# Altium schematic sheet EP4CE75.SchDoc
size A1
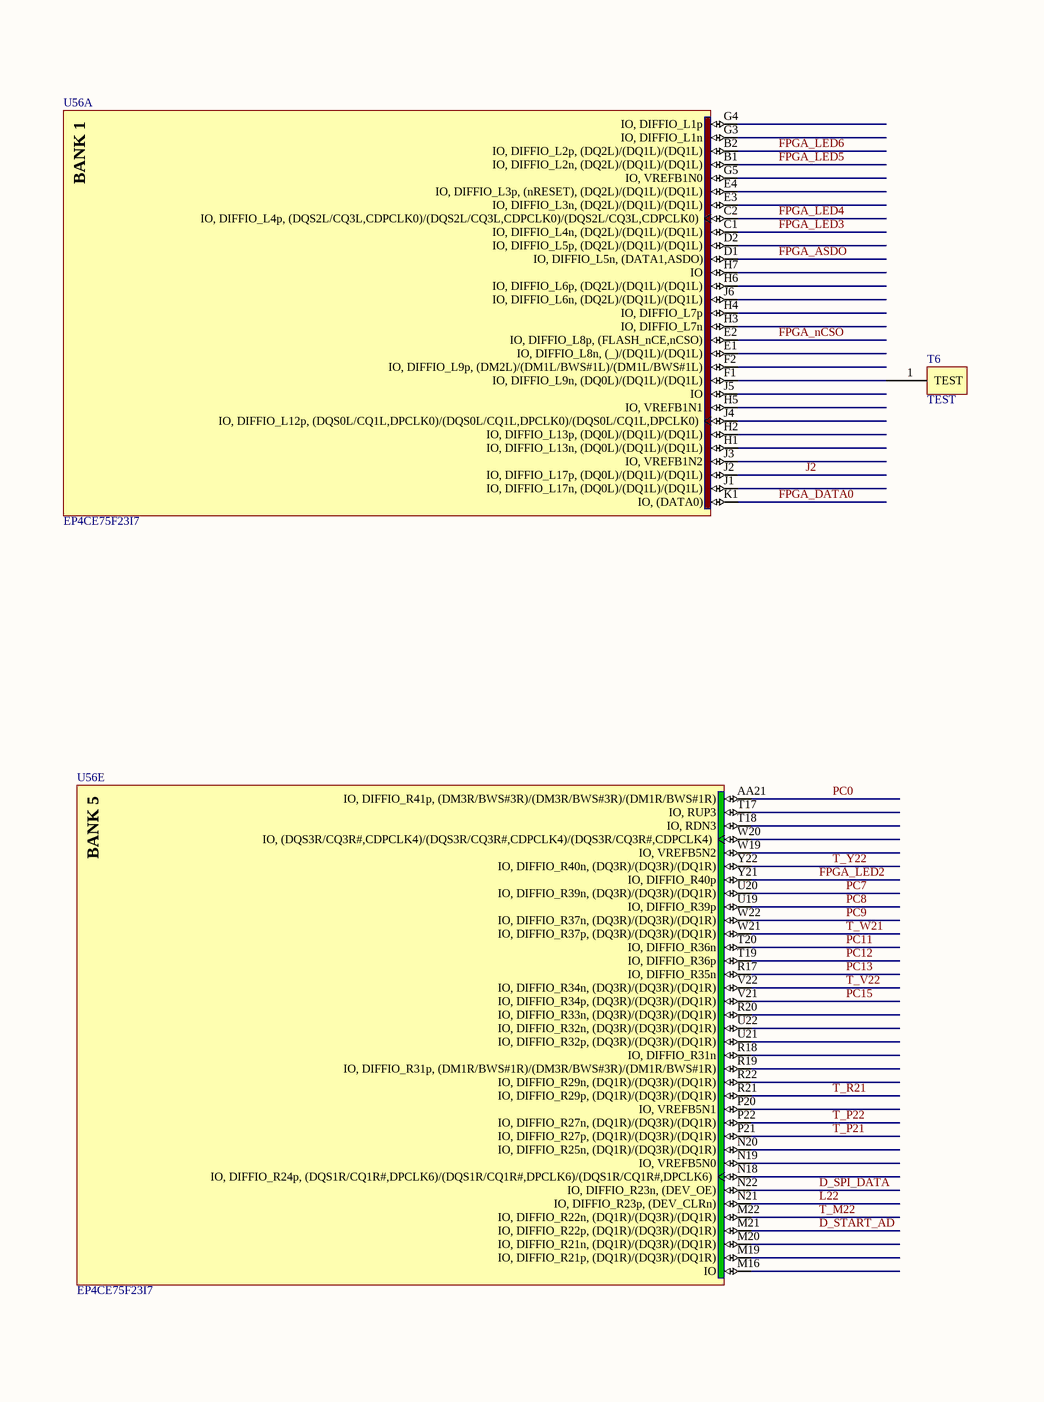
[diagram p0: EP4CE75.SchDoc, top left]
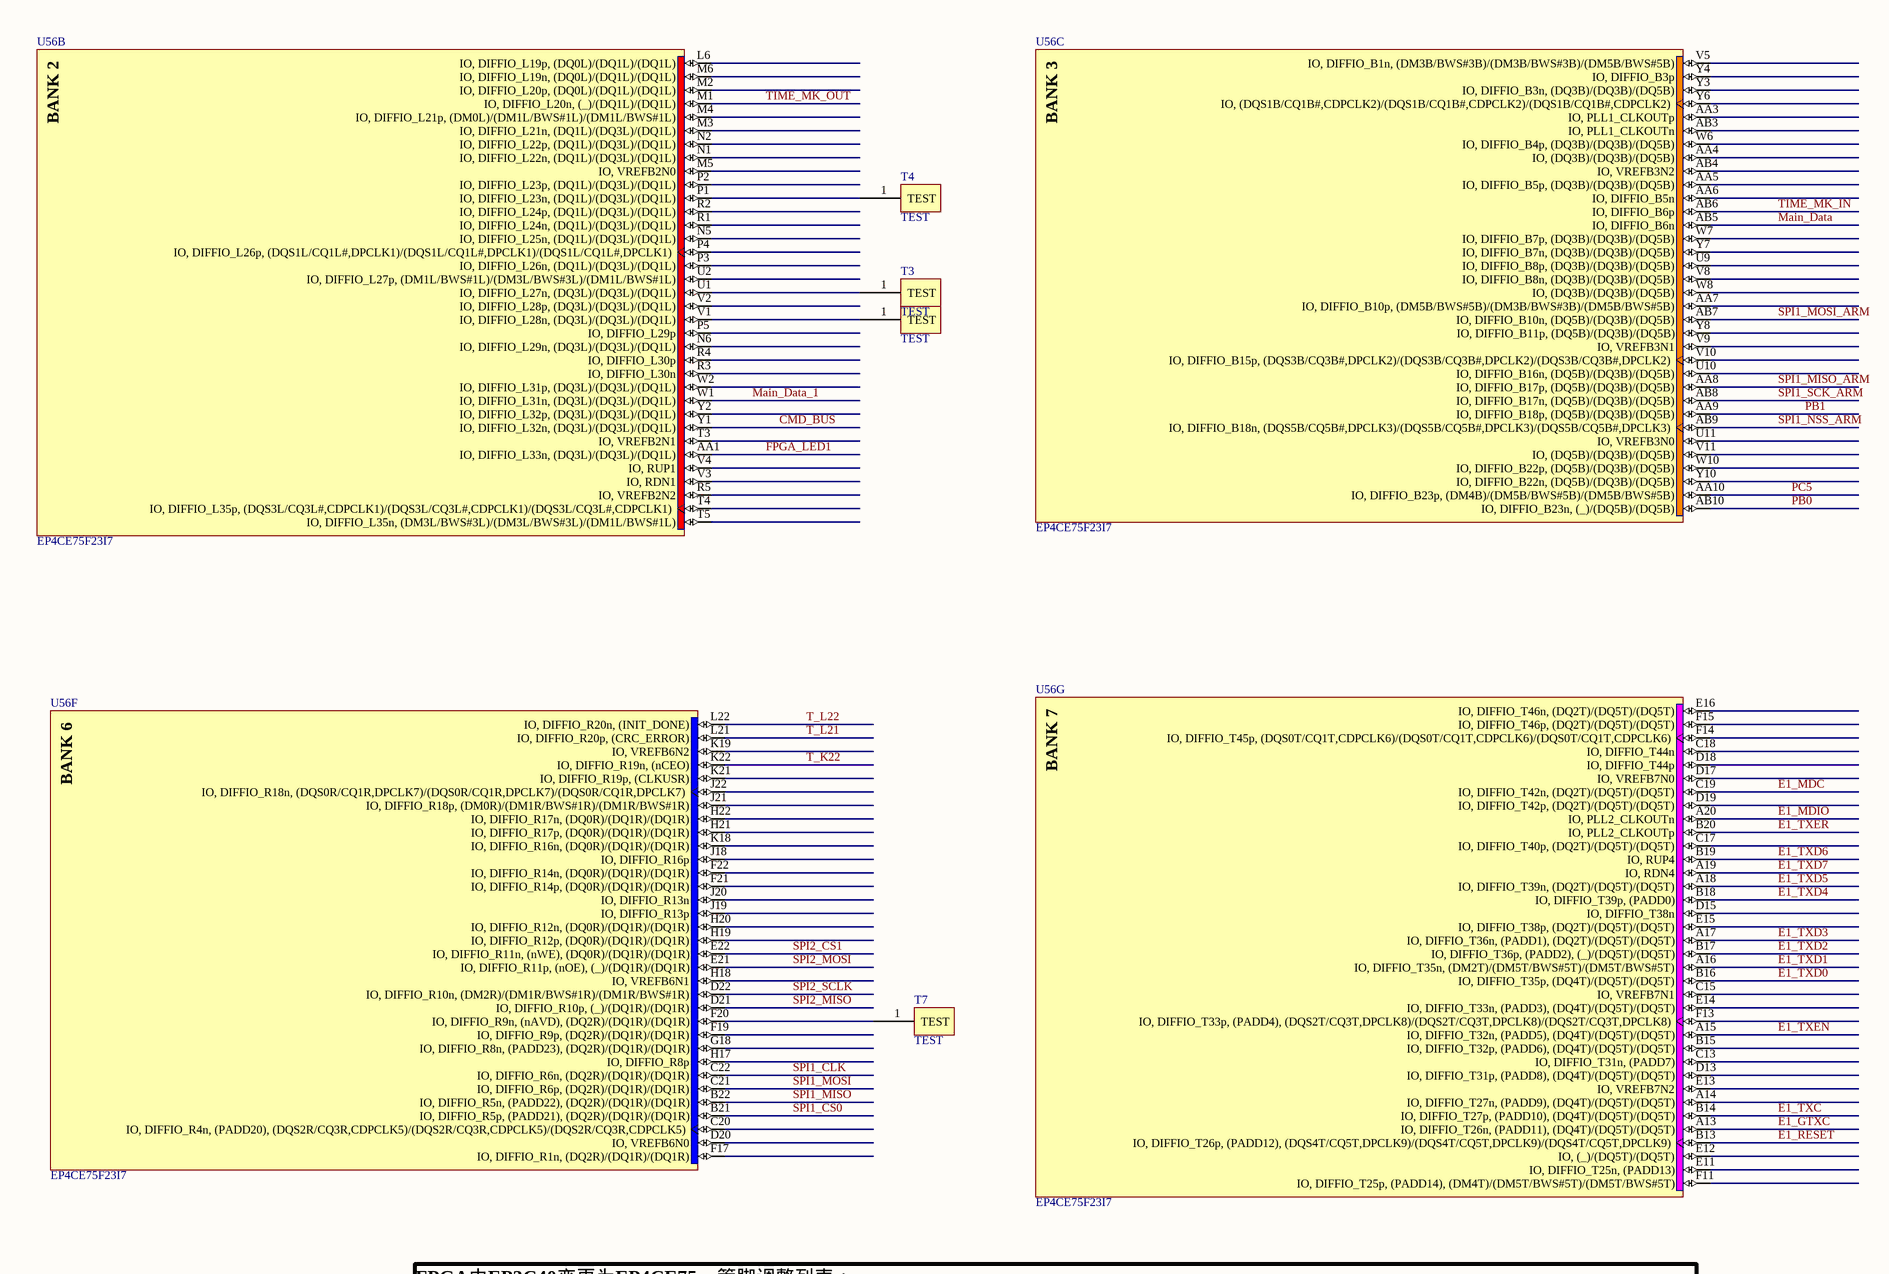
[diagram p1: EP4CE75.SchDoc, top middle]
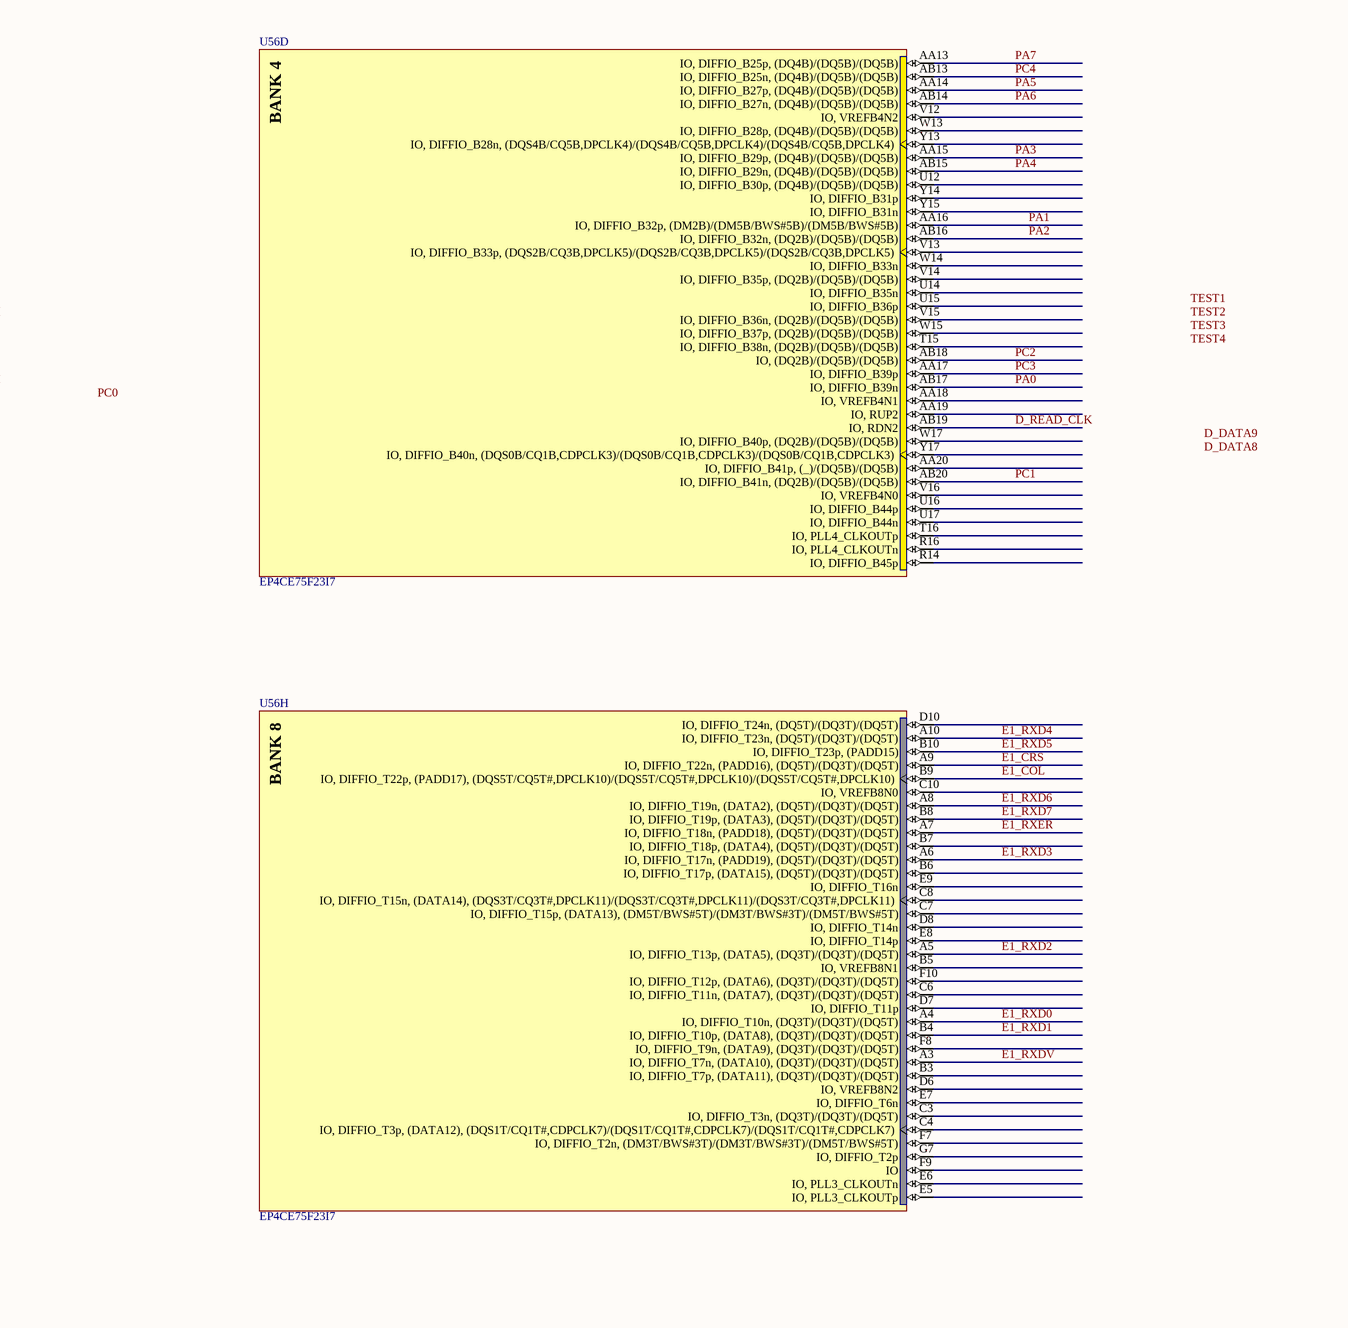
[diagram p2: EP4CE75.SchDoc, top right]
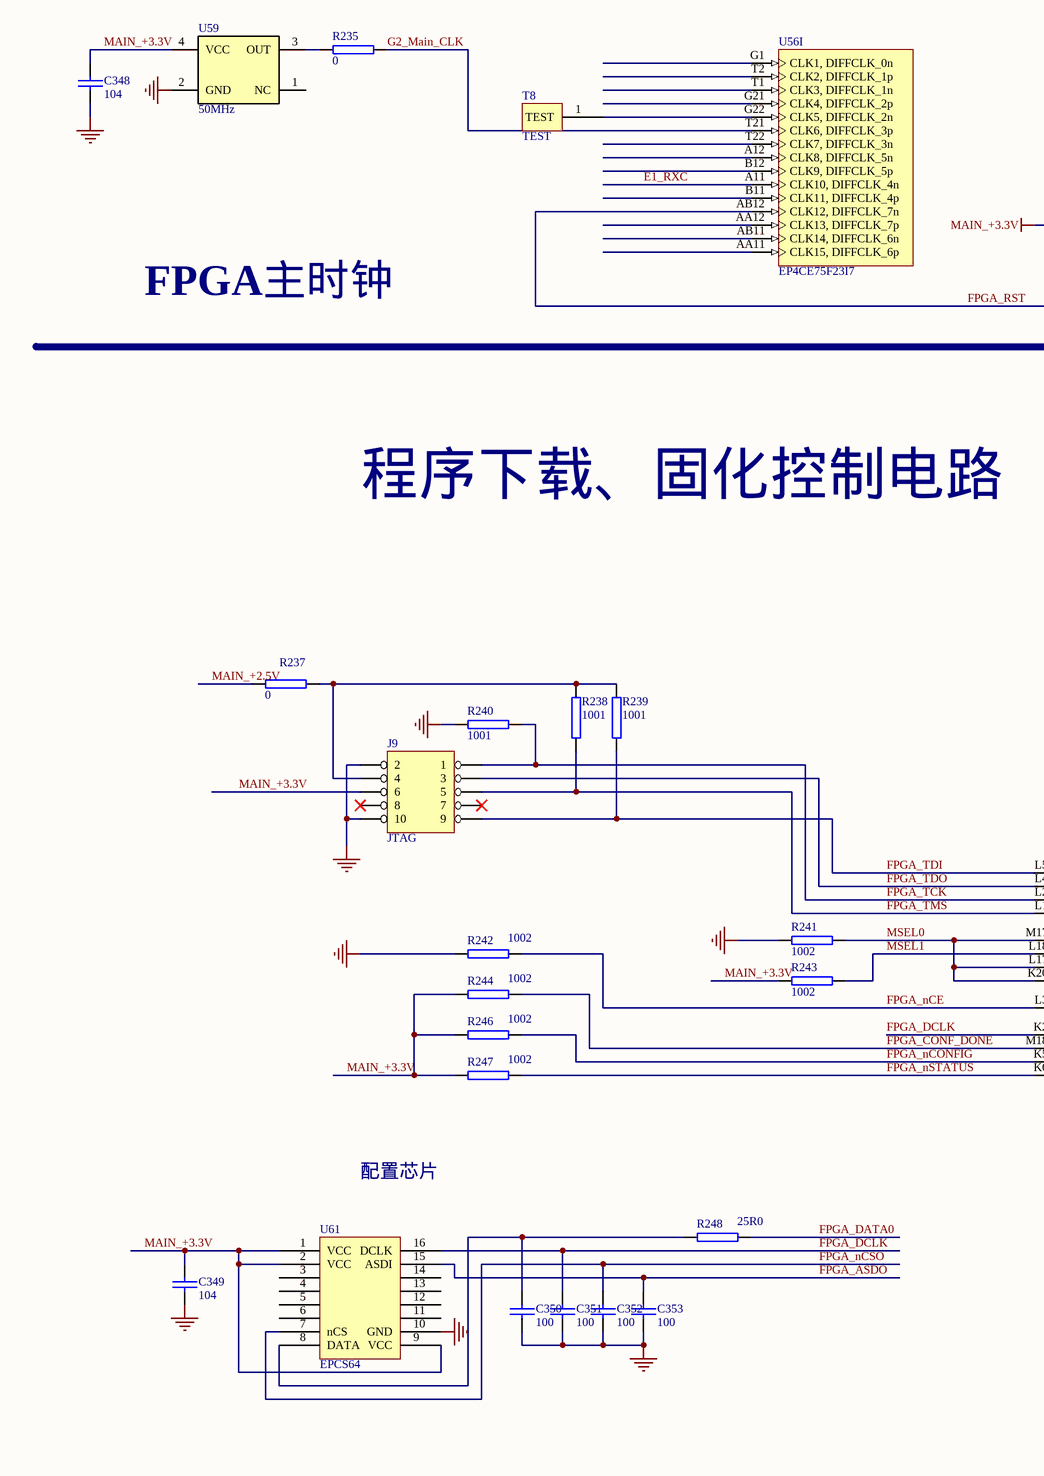
[diagram p3: EP4CE75.SchDoc, bottom left]
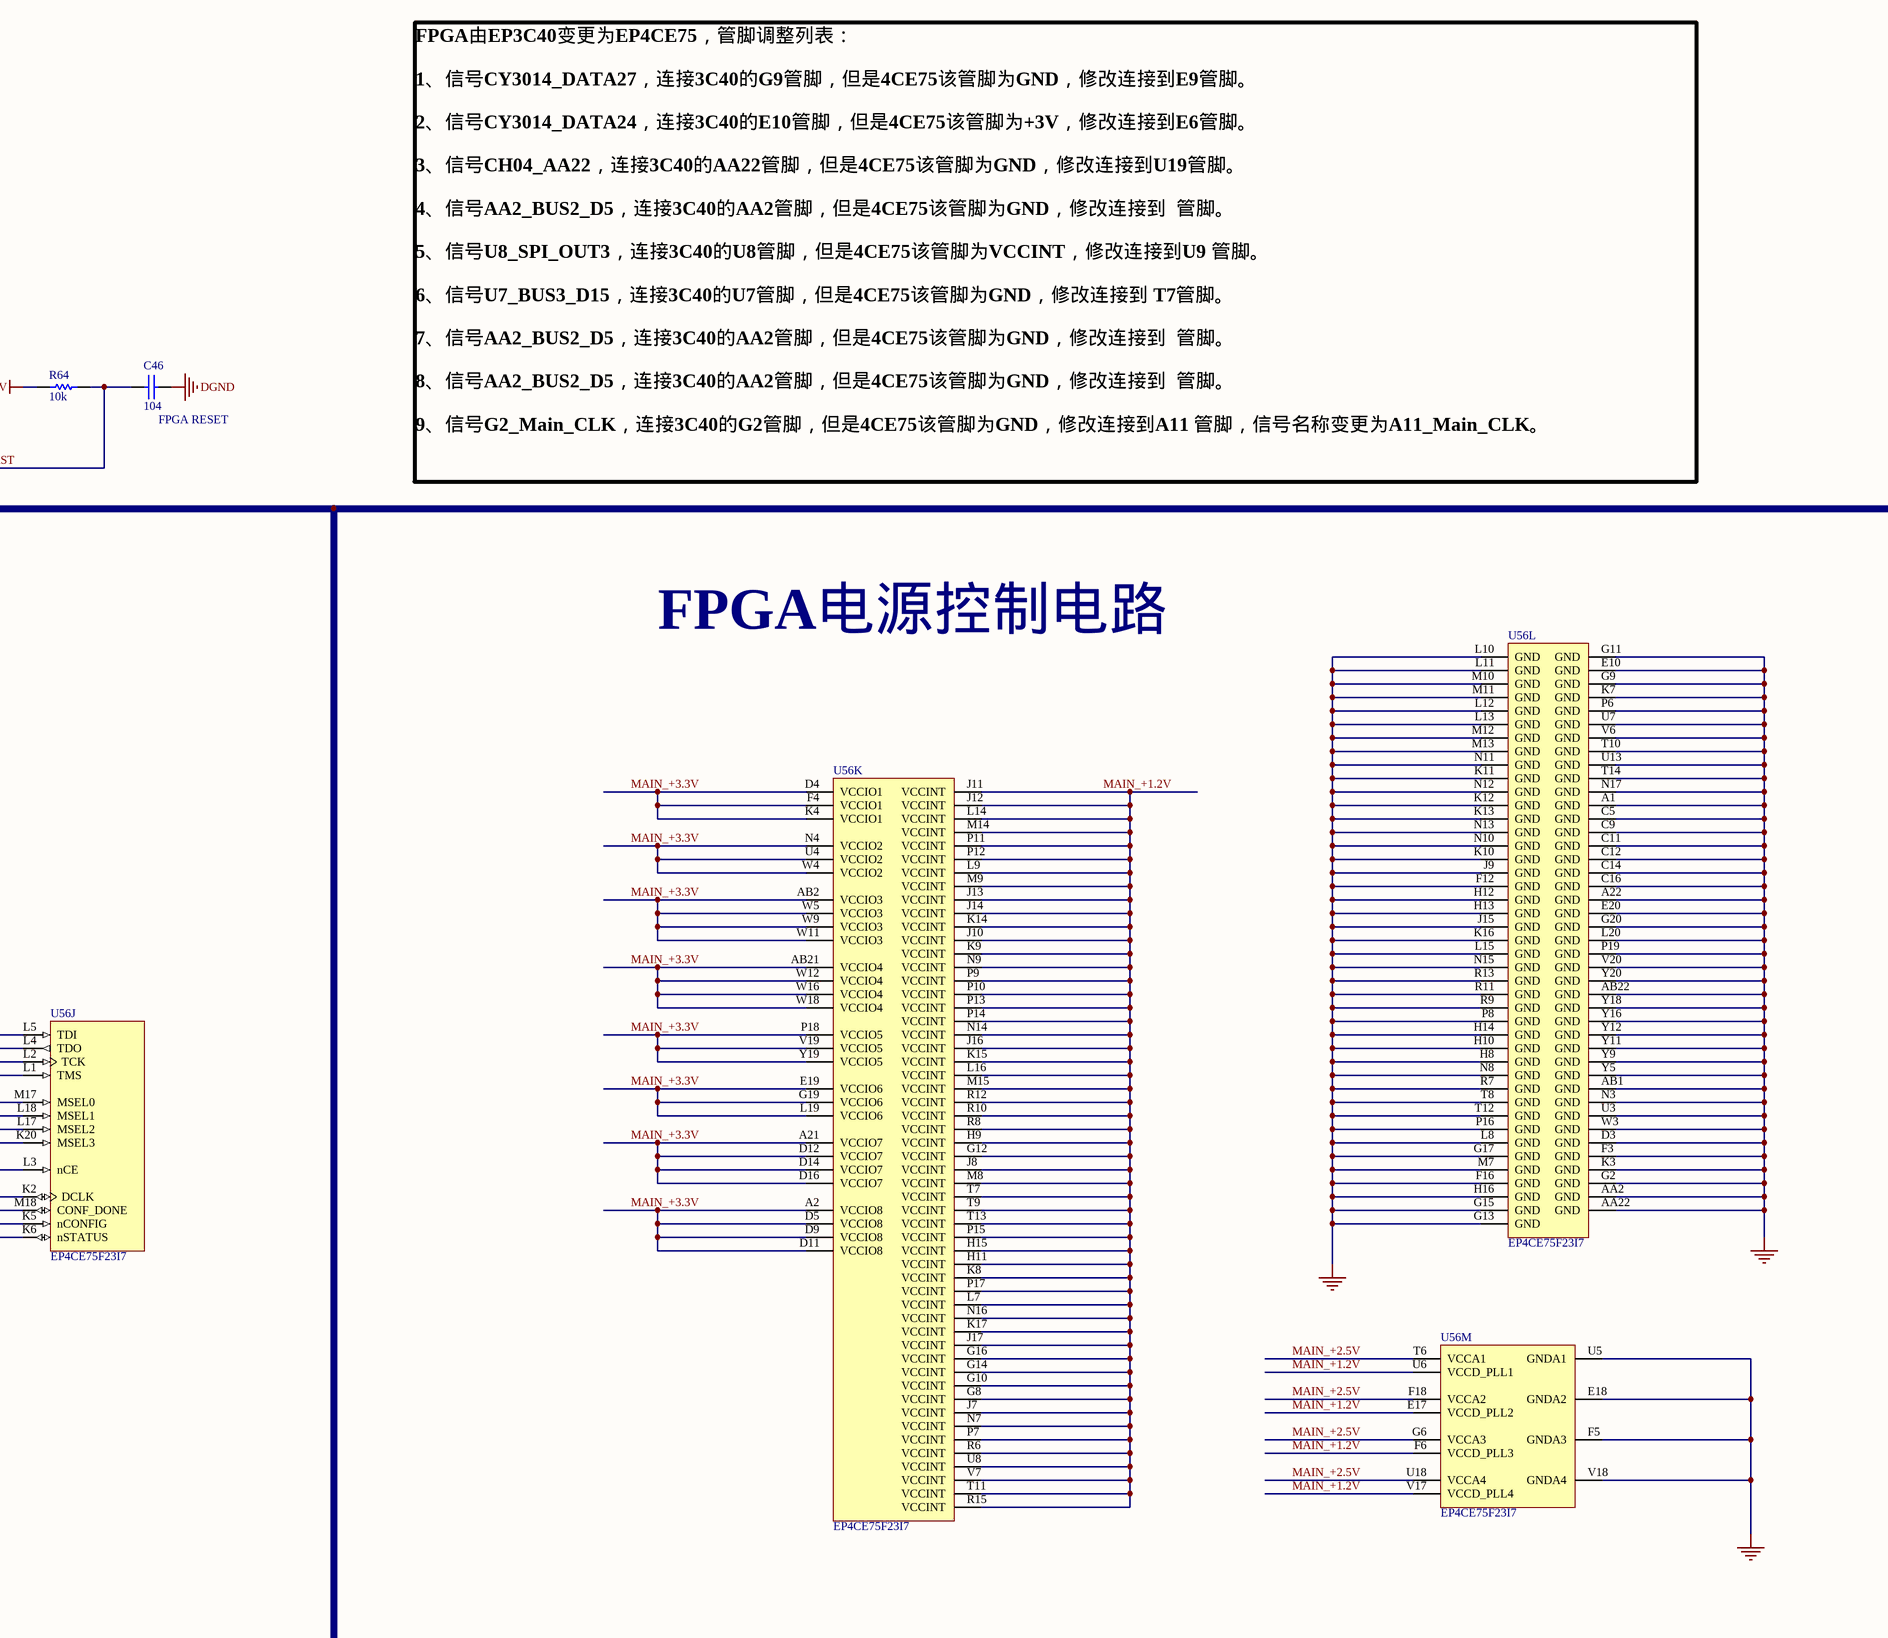
[diagram p4: EP4CE75.SchDoc, bottom middle]
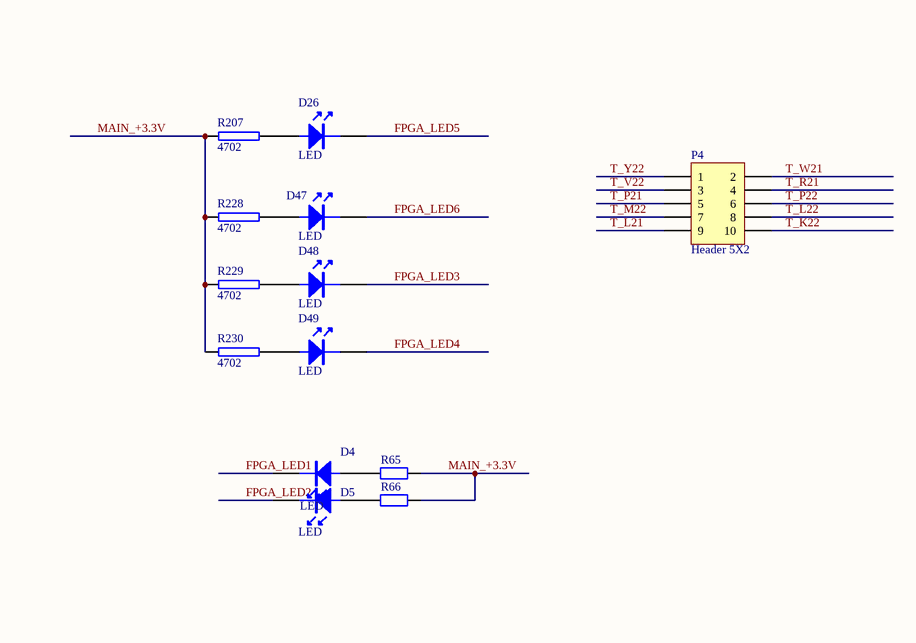
[diagram p5: EP4CE75.SchDoc, bottom right]

## Parts
C46  104  [0805C]
C348  104  [0805C]
C349  104  [0805C]
C350  100  [0805C]
C351  100  [0805C]
C352  100  [0805C]
C353  100  [0805C]
D4  LED  [0805_LED]
D5  LED  [0805_LED]
D26  LED  [0805_LED]
D47  LED  [0805_LED]
D48  LED  [0805_LED]
D49  LED  [0805_LED]
J9  JTAG  [IDC10]
P4  Header 5X2  [HDR2X5]
R64  10k  [0805R]
R65  4701  [0805R]  (value not drawn)
R66  4701  [0805R]  (value not drawn)
R207  4702  [0805R]
R228  4702  [0805R]
R229  4702  [0805R]
R230  4702  [0805R]
R235  0  [0805R]
R237  0  [0805R]
R238  1001  [0805R]
R239  1001  [0805R]
R240  1001  [0805R]
R241  1002  [0805R]
R242  1002  [0402]
R243  1002  [0805R]
R244  1002  [0402]
R246  1002  [0402]
R247  1002  [0402]
R248  25R0  [0805R]
T3  TEST  [TEST_MINI]
T4  TEST  [TEST_MINI]
T5  TEST  [TEST_MINI]
T6  TEST  [TEST_MINI]
T7  TEST  [TEST_MINI]
T8  TEST  [TEST_MINI]
U56  EP4CE75F23I7  [FBGA484-3]  (parts A,B,C,D,E,F,G,H,I,J,K,L,M of 13)
U59  50MHz  [CLOCK4]
U61  EPCS64  [EPCS64_SOIC16]

## Nets
DGND: C46.2 C348.1 C349.1 C350.1 C351.1 C352.1 C353.1 J9.2 J9.10 R240.1 R241.1 R242.2 U56.A1(GND) U56.A22(GND) U56.AA2(GND) U56.AA22(GND) U56.AB1(GND) U56.AB22(GND) U56.C5(GND) U56.C9(GND) U56.C11(GND) U56.C12(GND) U56.C14(GND) U56.C16(GND) U56.D3(GND) U56.E10(GND) U56.E18(GNDA2) U56.E20(GND) U56.F3(GND) U56.F5(GNDA3) U56.F12(GND) U56.F16(GND) U56.G2(GND) U56.G9(GND) U56.G11(GND) U56.G13(GND) U56.G15(GND) U56.G17(GND) U56.G20(GND) U56.H8(GND) U56.H10(GND) U56.H12(GND) U56.H13(GND) U56.H14(GND) U56.H16(GND) U56.J9(GND) U56.J15(GND) U56.K3(GND) U56.K7(GND) U56.K10(GND) U56.K11(GND) U56.K12(GND) U56.K13(GND) U56.K16(GND) U56.L8(GND) U56.L10(GND) U56.L11(GND) U56.L12(GND) U56.L13(GND) U56.L15(GND) U56.L20(GND) U56.M7(GND) U56.M10(GND) U56.M11(GND) U56.M12(GND) U56.M13(GND) U56.N3(GND) U56.N8(GND) U56.N10(GND) U56.N11(GND) U56.N12(GND) U56.N13(GND) U56.N15(GND) U56.N17(GND) U56.P6(GND) U56.P8(GND) U56.P16(GND) U56.P19(GND) U56.R7(GND) U56.R9(GND) U56.R11(GND) U56.R13(GND) U56.T8(GND) U56.T10(GND) U56.T12(GND) U56.T14(GND) U56.U3(GND) U56.U5(GNDA1) U56.U7(GND) U56.U13(GND) U56.V6(GND) U56.V18(GNDA4) U56.V20(GND) U56.W3(GND) U56.Y5(GND) U56.Y9(GND) U56.Y11(GND) U56.Y12(GND) U56.Y16(GND) U56.Y18(GND) U56.Y20(GND) U59.2(GND) U61.10(GND)
MAIN_+3.3V: C348.2 C349.2 J9.6 R64.2 R65.2 R66.2 R207.2 R228.2 R229.2 R230.2 R243.1 R244.1 R246.2 R247.2 U56.A2(VCCIO8) U56.A21(VCCIO7) U56.AB2(VCCIO3) U56.AB21(VCCIO4) U56.D4(VCCIO1) U56.D5(VCCIO8) U56.D9(VCCIO8) U56.D11(VCCIO8) U56.D12(VCCIO7) U56.D14(VCCIO7) U56.D16(VCCIO7) U56.E19(VCCIO6) U56.F4(VCCIO1) U56.G19(VCCIO6) U56.K4(VCCIO1) U56.L19(VCCIO6) U56.N4(VCCIO2) U56.P18(VCCIO5) U56.U4(VCCIO2) U56.V19(VCCIO5) U56.W4(VCCIO2) U56.W5(VCCIO3) U56.W9(VCCIO3) U56.W11(VCCIO3) U56.W12(VCCIO4) U56.W16(VCCIO4) U56.W18(VCCIO4) U56.Y19(VCCIO5) U59.4(VCC) U61.1(VCC) U61.2(VCC) U61.9(VCC)
CMD_BUS: U56.Y1(IO,_DIFFIO_L32n,_(DQ3L)/(DQ3L)/(DQ1L))
D_READ_CLK: U56.AB19(IO,_RDN2)
D_SPI_DATA: U56.N22(IO,_DIFFIO_R23n,_(DEV_OE))
D_START_AD: U56.M21(IO,_DIFFIO_R22p,_(DQ1R)/(DQ3R)/(DQ1R))
E1_COL: U56.B9(IO,_DIFFIO_T22p,_(PADD17),_(DQS5T/CQ5T#,DPCLK10)/(DQS5T/CQ5T#,DPCLK10)/(DQS5T/CQ5T#,DPCLK10))
E1_CRS: U56.A9(IO,_DIFFIO_T22n,_(PADD16),_(DQ5T)/(DQ3T)/(DQ5T))
E1_GTXC: U56.A13(IO,_DIFFIO_T26n,_(PADD11),_(DQ4T)/(DQ5T)/(DQ5T))
E1_MDC: U56.C19(IO,_DIFFIO_T42n,_(DQ2T)/(DQ5T)/(DQ5T))
E1_MDIO: U56.A20(IO,_PLL2_CLKOUTn)
E1_RESET: U56.B13(IO,_DIFFIO_T26p,_(PADD12),_(DQS4T/CQ5T,DPCLK9)/(DQS4T/CQ5T,DPCLK9)/(DQS4T/CQ5T,DPCLK9))
E1_RXC: U56.A11(CLK10,_DIFFCLK_4n)
E1_RXD0: U56.A4(IO,_DIFFIO_T10n,_(DQ3T)/(DQ3T)/(DQ5T))
E1_RXD1: U56.B4(IO,_DIFFIO_T10p,_(DATA8),_(DQ3T)/(DQ3T)/(DQ5T))
E1_RXD2: U56.A5(IO,_DIFFIO_T13p,_(DATA5),_(DQ3T)/(DQ3T)/(DQ5T))
E1_RXD3: U56.A6(IO,_DIFFIO_T17n,_(PADD19),_(DQ5T)/(DQ3T)/(DQ5T))
E1_RXD4: U56.A10(IO,_DIFFIO_T23n,_(DQ5T)/(DQ3T)/(DQ5T))
E1_RXD5: U56.B10(IO,_DIFFIO_T23p,_(PADD15))
E1_RXD6: U56.A8(IO,_DIFFIO_T19n,_(DATA2),_(DQ5T)/(DQ3T)/(DQ5T))
E1_RXD7: U56.B8(IO,_DIFFIO_T19p,_(DATA3),_(DQ5T)/(DQ3T)/(DQ5T))
E1_RXDV: U56.A3(IO,_DIFFIO_T7n,_(DATA10),_(DQ3T)/(DQ3T)/(DQ5T))
E1_RXER: U56.A7(IO,_DIFFIO_T18n,_(PADD18),_(DQ5T)/(DQ3T)/(DQ5T))
E1_TXC: U56.B14(IO,_DIFFIO_T27p,_(PADD10),_(DQ4T)/(DQ5T)/(DQ5T))
E1_TXD0: U56.B16(IO,_DIFFIO_T35p,_(DQ4T)/(DQ5T)/(DQ5T))
E1_TXD1: U56.A16(IO,_DIFFIO_T35n,_(DM2T)/(DM5T/BWS#5T)/(DM5T/BWS#5T))
E1_TXD2: U56.B17(IO,_DIFFIO_T36p,_(PADD2),_(_)/(DQ5T)/(DQ5T))
E1_TXD3: U56.A17(IO,_DIFFIO_T36n,_(PADD1),_(DQ2T)/(DQ5T)/(DQ5T))
E1_TXD4: U56.B18(IO,_DIFFIO_T39p,_(PADD0))
E1_TXD5: U56.A18(IO,_DIFFIO_T39n,_(DQ2T)/(DQ5T)/(DQ5T))
E1_TXD6: U56.B19(IO,_RUP4)
E1_TXD7: U56.A19(IO,_RDN4)
E1_TXEN: U56.A15(IO,_DIFFIO_T32n,_(PADD5),_(DQ4T)/(DQ5T)/(DQ5T))
E1_TXER: U56.B20(IO,_PLL2_CLKOUTp)
FPGA_ASDO: C353.2 U56.D1(IO,_DIFFIO_L5n,_(DATA1,ASDO)) U61.15(ASDI)
FPGA_CONF_DONE: R244.2 U56.M18(CONF_DONE)
FPGA_DATA0: R248.1 U56.K1(IO,_(DATA0))
FPGA_DCLK: C351.2 U56.K2(DCLK) U61.16(DCLK)
FPGA_LED1: D4.2(K) U56.AA1(IO,_DIFFIO_L33n,_(DQ3L)/(DQ3L)/(DQ1L))
FPGA_LED2: D5.2(K) U56.Y21(IO,_DIFFIO_R40p)
FPGA_LED3: D48.2(K) U56.C1(IO,_DIFFIO_L4n,_(DQ2L)/(DQ1L)/(DQ1L))
FPGA_LED4: D49.2(K) U56.C2(IO,_DIFFIO_L4p,_(DQS2L/CQ3L,CDPCLK0)/(DQS2L/CQ3L,CDPCLK0)/(DQS2L/CQ3L,CDPCLK0))
FPGA_LED5: D26.2(K) U56.B1(IO,_DIFFIO_L2n,_(DQ2L)/(DQ1L)/(DQ1L))
FPGA_LED6: D47.2(K) U56.B2(IO,_DIFFIO_L2p,_(DQ2L)/(DQ1L)/(DQ1L))
FPGA_nCE: R242.1 U56.L3(nCE)
FPGA_nCONFIG: R246.1 U56.K5(nCONFIG)
FPGA_nCSO: C352.2 U56.E2(IO,_DIFFIO_L8p,_(FLASH_nCE,nCSO)) U61.7(nCS)
FPGA_nSTATUS: R247.1 U56.K6(nSTATUS)
FPGA_RST: C46.1 R64.1 U56.AB12(CLK12,_DIFFCLK_7n)
FPGA_TCK: J9.1 R240.2 U56.L2(TCK)
FPGA_TDI: J9.9 R239.1 U56.L5(TDI)
FPGA_TDO: J9.3 U56.L4(TDO)
FPGA_TMS: J9.5 R238.1 U56.L1(TMS)
G2_Main_CLK: R235.2 U56.T21(CLK6,_DIFFCLK_3p)
J2: U56.J2(IO,_DIFFIO_L17p,_(DQ0L)/(DQ1L)/(DQ1L))
L22: U56.N21(IO,_DIFFIO_R23p,_(DEV_CLRn))
MAIN_+1.2V: U56.E17(VCCD_PLL2) U56.F6(VCCD_PLL3) U56.G8(VCCINT) U56.G10(VCCINT) U56.G12(VCCINT) U56.G14(VCCINT) U56.G16(VCCINT) U56.H9(VCCINT) U56.H11(VCCINT) U56.H15(VCCINT) U56.J7(VCCINT) U56.J8(VCCINT) U56.J10(VCCINT) U56.J11(VCCINT) U56.J12(VCCINT) U56.J13(VCCINT) U56.J14(VCCINT) U56.J16(VCCINT) U56.J17(VCCINT) U56.K8(VCCINT) U56.K9(VCCINT) U56.K14(VCCINT) U56.K15(VCCINT) U56.K17(VCCINT) U56.L7(VCCINT) U56.L9(VCCINT) U56.L14(VCCINT) U56.L16(VCCINT) U56.M8(VCCINT) U56.M9(VCCINT) U56.M14(VCCINT) U56.M15(VCCINT) U56.N7(VCCINT) U56.N9(VCCINT) U56.N14(VCCINT) U56.N16(VCCINT) U56.P7(VCCINT) U56.P9(VCCINT) U56.P10(VCCINT) U56.P11(VCCINT) U56.P12(VCCINT) U56.P13(VCCINT) U56.P14(VCCINT) U56.P15(VCCINT) U56.P17(VCCINT) U56.R6(VCCINT) U56.R8(VCCINT) U56.R10(VCCINT) U56.R12(VCCINT) U56.R15(VCCINT) U56.T7(VCCINT) U56.T9(VCCINT) U56.T11(VCCINT) U56.T13(VCCINT) U56.U6(VCCD_PLL1) U56.U8(VCCINT) U56.V7(VCCINT) U56.V17(VCCD_PLL4)
MAIN_+2.5V: R237.1 U56.F18(VCCA2) U56.G6(VCCA3) U56.T6(VCCA1) U56.U18(VCCA4)
Main_Data: U56.AB5(IO,_DIFFIO_B6n)
Main_Data_1: U56.W1(IO,_DIFFIO_L31n,_(DQ3L)/(DQ3L)/(DQ1L))
MSEL0: R241.2 U56.K20(MSEL3) U56.L17(MSEL2) U56.M17(MSEL0)
MSEL1: R243.2 U56.L18(MSEL1)
PA0: U56.AB17(IO,_DIFFIO_B39n)
PA1: U56.AA16(IO,_DIFFIO_B32p,_(DM2B)/(DM5B/BWS#5B)/(DM5B/BWS#5B))
PA2: U56.AB16(IO,_DIFFIO_B32n,_(DQ2B)/(DQ5B)/(DQ5B))
PA3: U56.AA15(IO,_DIFFIO_B29p,_(DQ4B)/(DQ5B)/(DQ5B))
PA4: U56.AB15(IO,_DIFFIO_B29n,_(DQ4B)/(DQ5B)/(DQ5B))
PA5: U56.AA14(IO,_DIFFIO_B27p,_(DQ4B)/(DQ5B)/(DQ5B))
PA6: U56.AB14(IO,_DIFFIO_B27n,_(DQ4B)/(DQ5B)/(DQ5B))
PA7: U56.AA13(IO,_DIFFIO_B25p,_(DQ4B)/(DQ5B)/(DQ5B))
PB0: U56.AB10(IO,_DIFFIO_B23n,_(_)/(DQ5B)/(DQ5B))
PB1: U56.AA9(IO,_DIFFIO_B18p,_(DQ5B)/(DQ3B)/(DQ5B))
PC0: U56.AA21(IO,_DIFFIO_R41p,_(DM3R/BWS#3R)/(DM3R/BWS#3R)/(DM1R/BWS#1R))
PC1: U56.AB20(IO,_DIFFIO_B41n,_(DQ2B)/(DQ5B)/(DQ5B))
PC2: U56.AB18(IO,_(DQ2B)/(DQ5B)/(DQ5B))
PC3: U56.AA17(IO,_DIFFIO_B39p)
PC4: U56.AB13(IO,_DIFFIO_B25n,_(DQ4B)/(DQ5B)/(DQ5B))
PC5: U56.AA10(IO,_DIFFIO_B23p,_(DM4B)/(DM5B/BWS#5B)/(DM5B/BWS#5B))
PC7: U56.U20(IO,_DIFFIO_R39n,_(DQ3R)/(DQ3R)/(DQ1R))
PC8: U56.U19(IO,_DIFFIO_R39p)
PC9: U56.W22(IO,_DIFFIO_R37n,_(DQ3R)/(DQ3R)/(DQ1R))
PC11: U56.T20(IO,_DIFFIO_R36n)
PC12: U56.T19(IO,_DIFFIO_R36p)
PC13: U56.R17(IO,_DIFFIO_R35n)
PC15: U56.V21(IO,_DIFFIO_R34p,_(DQ3R)/(DQ3R)/(DQ1R))
SPI1_CLK: U56.C22(IO,_DIFFIO_R6n,_(DQ2R)/(DQ1R)/(DQ1R))
SPI1_CS0: U56.B21(IO,_DIFFIO_R5p,_(PADD21),_(DQ2R)/(DQ1R)/(DQ1R))
SPI1_MISO: U56.B22(IO,_DIFFIO_R5n,_(PADD22),_(DQ2R)/(DQ1R)/(DQ1R))
SPI1_MISO_ARM: U56.AA8(IO,_DIFFIO_B17p,_(DQ5B)/(DQ3B)/(DQ5B))
SPI1_MOSI: U56.C21(IO,_DIFFIO_R6p,_(DQ2R)/(DQ1R)/(DQ1R))
SPI1_MOSI_ARM: U56.AB7(IO,_DIFFIO_B10n,_(DQ5B)/(DQ3B)/(DQ5B))
SPI1_NSS_ARM: U56.AB9(IO,_DIFFIO_B18n,_(DQS5B/CQ5B#,DPCLK3)/(DQS5B/CQ5B#,DPCLK3)/(DQS5B/CQ5B#,DPCLK3))
SPI1_SCK_ARM: U56.AB8(IO,_DIFFIO_B17n,_(DQ5B)/(DQ3B)/(DQ5B))
SPI2_CS1: U56.E22(IO,_DIFFIO_R11n,_(nWE),_(DQ0R)/(DQ1R)/(DQ1R))
SPI2_MISO: U56.D21(IO,_DIFFIO_R10p,_(_)/(DQ1R)/(DQ1R))
SPI2_MOSI: U56.E21(IO,_DIFFIO_R11p,_(nOE),_(_)/(DQ1R)/(DQ1R))
SPI2_SCLK: U56.D22(IO,_DIFFIO_R10n,_(DM2R)/(DM1R/BWS#1R)/(DM1R/BWS#1R))
T_K22: P4.10 U56.K22(IO,_DIFFIO_R19n,_(nCEO))
T_L21: P4.9 U56.L21(IO,_DIFFIO_R20p,_(CRC_ERROR))
T_L22: P4.8 U56.L22(IO,_DIFFIO_R20n,_(INIT_DONE))
T_M22: P4.7 U56.M22(IO,_DIFFIO_R22n,_(DQ1R)/(DQ3R)/(DQ1R))
T_P21: P4.5 U56.P21(IO,_DIFFIO_R27p,_(DQ1R)/(DQ3R)/(DQ1R))
T_P22: P4.6 U56.P22(IO,_DIFFIO_R27n,_(DQ1R)/(DQ3R)/(DQ1R))
T_R21: P4.4 U56.R21(IO,_DIFFIO_R29p,_(DQ1R)/(DQ3R)/(DQ1R))
T_V22: P4.3 U56.V22(IO,_DIFFIO_R34n,_(DQ3R)/(DQ3R)/(DQ1R))
T_W21: P4.2 U56.W21(IO,_DIFFIO_R37p,_(DQ3R)/(DQ3R)/(DQ1R))
T_Y22: P4.1 U56.Y22(IO,_DIFFIO_R40n,_(DQ3R)/(DQ3R)/(DQ1R))
TIME_MK_IN: U56.AB6(IO,_DIFFIO_B6p)
TIME_MK_OUT: U56.M1(IO,_DIFFIO_L20n,_(_)/(DQ1L)/(DQ1L))
NetC350_2: C350.2 R248.2 U61.8(DATA)
NetD4_1: D4.1(A) R65.1
NetD5_1: D5.1(A) R66.1
NetD26_1: D26.1(A) R207.1
NetD47_1: D47.1(A) R228.1
NetD48_1: D48.1(A) R229.1
NetD49_1: D49.1(A) R230.1
NetJ9_4: J9.4 R237.2 R238.2 R239.2
NetR235_1: R235.1 U59.3(OUT)
NetT3_1: T3.1(TEST) U56.U1(IO,_DIFFIO_L27n,_(DQ3L)/(DQ3L)/(DQ1L))
NetT4_1: T4.1(TEST) U56.P1(IO,_DIFFIO_L23n,_(DQ1L)/(DQ3L)/(DQ1L))
NetT5_1: T5.1(TEST) U56.V1(IO,_DIFFIO_L28n,_(DQ3L)/(DQ3L)/(DQ1L))
NetT6_1: T6.1(TEST) U56.F1(IO,_DIFFIO_L9n,_(DQ0L)/(DQ1L)/(DQ1L))
NetT7_1: T7.1(TEST) U56.F20(IO,_DIFFIO_R9n,_(nAVD),_(DQ2R)/(DQ1R)/(DQ1R))
NetT8_1: T8.1(TEST) U56.G22(CLK5,_DIFFCLK_2n)

Not connected (* = marked no-connect by the designer): J9 7* 8*; U56 A12(CLK8,_DIFFCLK_5n) A14(IO,_DIFFIO_T27n,_(PADD9),_(DQ4T)/(DQ5T)/(DQ5T)) AA3(IO,_PLL1_CLKOUTp) AA4(IO,_(DQ3B)/(DQ3B)/(DQ5B)) AA5(IO,_DIFFIO_B5p,_(DQ3B)/(DQ3B)/(DQ5B)) AA6(IO,_DIFFIO_B5n) AA7(IO,_DIFFIO_B10p,_(DM5B/BWS#5B)/(DM3B/BWS#3B)/(DM5B/BWS#5B)) AA11(CLK15,_DIFFCLK_6p) AA12(CLK13,_DIFFCLK_7p) AA18(IO,_VREFB4N1) AA19(IO,_RUP2) AA20(IO,_DIFFIO_B41p,_(_)/(DQ5B)/(DQ5B)) AB3(IO,_PLL1_CLKOUTn) AB4(IO,_VREFB3N2) AB11(CLK14,_DIFFCLK_6n) B3(IO,_DIFFIO_T7p,_(DATA11),_(DQ3T)/(DQ3T)/(DQ5T)) B5(IO,_VREFB8N1) B6(IO,_DIFFIO_T17p,_(DATA15),_(DQ5T)/(DQ3T)/(DQ5T)) B7(IO,_DIFFIO_T18p,_(DATA4),_(DQ5T)/(DQ3T)/(DQ5T)) B11(CLK11,_DIFFCLK_4p) B12(CLK9,_DIFFCLK_5p) B15(IO,_DIFFIO_T32p,_(PADD6),_(DQ4T)/(DQ5T)/(DQ5T)) C3(IO,_DIFFIO_T3n,_(DQ3T)/(DQ3T)/(DQ5T)) C4(IO,_DIFFIO_T3p,_(DATA12),_(DQS1T/CQ1T#,CDPCLK7)/(DQS1T/CQ1T#,CDPCLK7)/(DQS1T/CQ1T#,CDPCLK7)) C6(IO,_DIFFIO_T11n,_(DATA7),_(DQ3T)/(DQ3T)/(DQ5T)) C7(IO,_DIFFIO_T15p,_(DATA13),_(DM5T/BWS#5T)/(DM3T/BWS#3T)/(DM5T/BWS#5T)) C8(IO,_DIFFIO_T15n,_(DATA14),_(DQS3T/CQ3T#,DPCLK11)/(DQS3T/CQ3T#,DPCLK11)/(DQS3T/CQ3T#,DPCLK11)) C10(IO,_VREFB8N0) C13(IO,_DIFFIO_T31n,_(PADD7)) C15(IO,_VREFB7N1) C17(IO,_DIFFIO_T40p,_(DQ2T)/(DQ5T)/(DQ5T)) C18(IO,_DIFFIO_T44n) C20(IO,_DIFFIO_R4n,_(PADD20),_(DQS2R/CQ3R,CDPCLK5)/(DQS2R/CQ3R,CDPCLK5)/(DQS2R/CQ3R,CDPCLK5)) D2(IO,_DIFFIO_L5p,_(DQ2L)/(DQ1L)/(DQ1L)) D6(IO,_VREFB8N2) D7(IO,_DIFFIO_T11p) D8(IO,_DIFFIO_T14n) D10(IO,_DIFFIO_T24n,_(DQ5T)/(DQ3T)/(DQ5T)) D13(IO,_DIFFIO_T31p,_(PADD8),_(DQ4T)/(DQ5T)/(DQ5T)) D15(IO,_DIFFIO_T38n) D17(IO,_VREFB7N0) D18(IO,_DIFFIO_T44p) D19(IO,_DIFFIO_T42p,_(DQ2T)/(DQ5T)/(DQ5T)) D20(IO,_VREFB6N0) E1(IO,_DIFFIO_L8n,_(_)/(DQ1L)/(DQ1L)) E3(IO,_DIFFIO_L3n,_(DQ2L)/(DQ1L)/(DQ1L)) E4(IO,_DIFFIO_L3p,_(nRESET),_(DQ2L)/(DQ1L)/(DQ1L)) E5(IO,_PLL3_CLKOUTp) E6(IO,_PLL3_CLKOUTn) E7(IO,_DIFFIO_T6n) E8(IO,_DIFFIO_T14p) E9(IO,_DIFFIO_T16n) E11(IO,_DIFFIO_T25n,_(PADD13)) E12(IO,_(_)/(DQ5T)/(DQ5T)) E13(IO,_VREFB7N2) E14(IO,_DIFFIO_T33n,_(PADD3),_(DQ4T)/(DQ5T)/(DQ5T)) E15(IO,_DIFFIO_T38p,_(DQ2T)/(DQ5T)/(DQ5T)) E16(IO,_DIFFIO_T46n,_(DQ2T)/(DQ5T)/(DQ5T)) F2(IO,_DIFFIO_L9p,_(DM2L)/(DM1L/BWS#1L)/(DM1L/BWS#1L)) F7(IO,_DIFFIO_T2n,_(DM3T/BWS#3T)/(DM3T/BWS#3T)/(DM5T/BWS#5T)) F8(IO,_DIFFIO_T9n,_(DATA9),_(DQ3T)/(DQ3T)/(DQ5T)) F9(IO) F10(IO,_DIFFIO_T12p,_(DATA6),_(DQ3T)/(DQ3T)/(DQ5T)) F11(IO,_DIFFIO_T25p,_(PADD14),_(DM4T)/(DM5T/BWS#5T)/(DM5T/BWS#5T)) F13(IO,_DIFFIO_T33p,_(PADD4),_(DQS2T/CQ3T,DPCLK8)/(DQS2T/CQ3T,DPCLK8)/(DQS2T/CQ3T,DPCLK8)) F14(IO,_DIFFIO_T45p,_(DQS0T/CQ1T,CDPCLK6)/(DQS0T/CQ1T,CDPCLK6)/(DQS0T/CQ1T,CDPCLK6)) F15(IO,_DIFFIO_T46p,_(DQ2T)/(DQ5T)/(DQ5T)) F17(IO,_DIFFIO_R1n,_(DQ2R)/(DQ1R)/(DQ1R)) F19(IO,_DIFFIO_R9p,_(DQ2R)/(DQ1R)/(DQ1R)) F21(IO,_DIFFIO_R14p,_(DQ0R)/(DQ1R)/(DQ1R)) F22(IO,_DIFFIO_R14n,_(DQ0R)/(DQ1R)/(DQ1R)) G1(CLK1,_DIFFCLK_0n) G3(IO,_DIFFIO_L1n) G4(IO,_DIFFIO_L1p) G5(IO,_VREFB1N0) G7(IO,_DIFFIO_T2p) G18(IO,_DIFFIO_R8n,_(PADD23),_(DQ2R)/(DQ1R)/(DQ1R)) G21(CLK4,_DIFFCLK_2p) H1(IO,_DIFFIO_L13n,_(DQ0L)/(DQ1L)/(DQ1L)) H2(IO,_DIFFIO_L13p,_(DQ0L)/(DQ1L)/(DQ1L)) H3(IO,_DIFFIO_L7n) H4(IO,_DIFFIO_L7p) H5(IO,_VREFB1N1) H6(IO,_DIFFIO_L6p,_(DQ2L)/(DQ1L)/(DQ1L)) H7(IO) H17(IO,_DIFFIO_R8p) H18(IO,_VREFB6N1) H19(IO,_DIFFIO_R12p,_(DQ0R)/(DQ1R)/(DQ1R)) H20(IO,_DIFFIO_R12n,_(DQ0R)/(DQ1R)/(DQ1R)) H21(IO,_DIFFIO_R17p,_(DQ0R)/(DQ1R)/(DQ1R)) H22(IO,_DIFFIO_R17n,_(DQ0R)/(DQ1R)/(DQ1R)) J1(IO,_DIFFIO_L17n,_(DQ0L)/(DQ1L)/(DQ1L)) J3(IO,_VREFB1N2) J4(IO,_DIFFIO_L12p,_(DQS0L/CQ1L,DPCLK0)/(DQS0L/CQ1L,DPCLK0)/(DQS0L/CQ1L,DPCLK0)) J5(IO) J6(IO,_DIFFIO_L6n,_(DQ2L)/(DQ1L)/(DQ1L)) J18(IO,_DIFFIO_R16p) J19(IO,_DIFFIO_R13p) J20(IO,_DIFFIO_R13n) J21(IO,_DIFFIO_R18p,_(DM0R)/(DM1R/BWS#1R)/(DM1R/BWS#1R)) J22(IO,_DIFFIO_R18n,_(DQS0R/CQ1R,DPCLK7)/(DQS0R/CQ1R,DPCLK7)/(DQS0R/CQ1R,DPCLK7)) K18(IO,_DIFFIO_R16n,_(DQ0R)/(DQ1R)/(DQ1R)) K19(IO,_VREFB6N2) K21(IO,_DIFFIO_R19p,_(CLKUSR)) L6(IO,_DIFFIO_L19p,_(DQ0L)/(DQ1L)/(DQ1L)) M2(IO,_DIFFIO_L20p,_(DQ0L)/(DQ1L)/(DQ1L)) M3(IO,_DIFFIO_L21n,_(DQ1L)/(DQ3L)/(DQ1L)) M4(IO,_DIFFIO_L21p,_(DM0L)/(DM1L/BWS#1L)/(DM1L/BWS#1L)) M5(IO,_VREFB2N0) M6(IO,_DIFFIO_L19n,_(DQ0L)/(DQ1L)/(DQ1L)) M16(IO) M19(IO,_DIFFIO_R21p,_(DQ1R)/(DQ3R)/(DQ1R)) M20(IO,_DIFFIO_R21n,_(DQ1R)/(DQ3R)/(DQ1R)) N1(IO,_DIFFIO_L22n,_(DQ1L)/(DQ3L)/(DQ1L)) N2(IO,_DIFFIO_L22p,_(DQ1L)/(DQ3L)/(DQ1L)) N5(IO,_DIFFIO_L25n,_(DQ1L)/(DQ3L)/(DQ1L)) N6(IO,_DIFFIO_L29n,_(DQ3L)/(DQ3L)/(DQ1L)) N18(IO,_DIFFIO_R24p,_(DQS1R/CQ1R#,DPCLK6)/(DQS1R/CQ1R#,DPCLK6)/(DQS1R/CQ1R#,DPCLK6)) N19(IO,_VREFB5N0) N20(IO,_DIFFIO_R25n,_(DQ1R)/(DQ3R)/(DQ1R)) P2(IO,_DIFFIO_L23p,_(DQ1L)/(DQ3L)/(DQ1L)) P3(IO,_DIFFIO_L26n,_(DQ1L)/(DQ3L)/(DQ1L)) P4(IO,_DIFFIO_L26p,_(DQS1L/CQ1L#,DPCLK1)/(DQS1L/CQ1L#,DPCLK1)/(DQS1L/CQ1L#,DPCLK1)) P5(IO,_DIFFIO_L29p) P20(IO,_VREFB5N1) R1(IO,_DIFFIO_L24n,_(DQ1L)/(DQ3L)/(DQ1L)) R2(IO,_DIFFIO_L24p,_(DQ1L)/(DQ3L)/(DQ1L)) R3(IO,_DIFFIO_L30n) R4(IO,_DIFFIO_L30p) R5(IO,_VREFB2N2) R14(IO,_DIFFIO_B45p) R16(IO,_PLL4_CLKOUTn) R18(IO,_DIFFIO_R31n) R19(IO,_DIFFIO_R31p,_(DM1R/BWS#1R)/(DM3R/BWS#3R)/(DM1R/BWS#1R)) R20(IO,_DIFFIO_R33n,_(DQ3R)/(DQ3R)/(DQ1R)) R22(IO,_DIFFIO_R29n,_(DQ1R)/(DQ3R)/(DQ1R)) T1(CLK3,_DIFFCLK_1n) T2(CLK2,_DIFFCLK_1p) T3(IO,_VREFB2N1) T4(IO,_DIFFIO_L35p,_(DQS3L/CQ3L#,CDPCLK1)/(DQS3L/CQ3L#,CDPCLK1)/(DQS3L/CQ3L#,CDPCLK1)) T5(IO,_DIFFIO_L35n,_(DM3L/BWS#3L)/(DM3L/BWS#3L)/(DM1L/BWS#1L)) T15(IO,_DIFFIO_B38n,_(DQ2B)/(DQ5B)/(DQ5B)) T16(IO,_PLL4_CLKOUTp) T17(IO,_RUP3) T18(IO,_RDN3) T22(CLK7,_DIFFCLK_3n) U2(IO,_DIFFIO_L27p,_(DM1L/BWS#1L)/(DM3L/BWS#3L)/(DM1L/BWS#1L)) U9(IO,_DIFFIO_B8p,_(DQ3B)/(DQ3B)/(DQ5B)) U10(IO,_DIFFIO_B16n,_(DQ5B)/(DQ3B)/(DQ5B)) U11(IO,_VREFB3N0) U12(IO,_DIFFIO_B30p,_(DQ4B)/(DQ5B)/(DQ5B)) U14(IO,_DIFFIO_B35n) U15(IO,_DIFFIO_B36p) U16(IO,_DIFFIO_B44p) U17(IO,_DIFFIO_B44n) U21(IO,_DIFFIO_R32p,_(DQ3R)/(DQ3R)/(DQ1R)) U22(IO,_DIFFIO_R32n,_(DQ3R)/(DQ3R)/(DQ1R)) V2(IO,_DIFFIO_L28p,_(DQ3L)/(DQ3L)/(DQ1L)) V3(IO,_RDN1) V4(IO,_RUP1) V5(IO,_DIFFIO_B1n,_(DM3B/BWS#3B)/(DM3B/BWS#3B)/(DM5B/BWS#5B)) V8(IO,_DIFFIO_B8n,_(DQ3B)/(DQ3B)/(DQ5B)) V9(IO,_VREFB3N1) V10(IO,_DIFFIO_B15p,_(DQS3B/CQ3B#,DPCLK2)/(DQS3B/CQ3B#,DPCLK2)/(DQS3B/CQ3B#,DPCLK2)) V11(IO,_(DQ5B)/(DQ3B)/(DQ5B)) V12(IO,_VREFB4N2) V13(IO,_DIFFIO_B33p,_(DQS2B/CQ3B,DPCLK5)/(DQS2B/CQ3B,DPCLK5)/(DQS2B/CQ3B,DPCLK5)) V14(IO,_DIFFIO_B35p,_(DQ2B)/(DQ5B)/(DQ5B)) V15(IO,_DIFFIO_B36n,_(DQ2B)/(DQ5B)/(DQ5B)) V16(IO,_VREFB4N0) W2(IO,_DIFFIO_L31p,_(DQ3L)/(DQ3L)/(DQ1L)) W6(IO,_DIFFIO_B4p,_(DQ3B)/(DQ3B)/(DQ5B)) W7(IO,_DIFFIO_B7p,_(DQ3B)/(DQ3B)/(DQ5B)) W8(IO,_(DQ3B)/(DQ3B)/(DQ5B)) W10(IO,_DIFFIO_B22p,_(DQ5B)/(DQ3B)/(DQ5B)) W13(IO,_DIFFIO_B28p,_(DQ4B)/(DQ5B)/(DQ5B)) W14(IO,_DIFFIO_B33n) W15(IO,_DIFFIO_B37p,_(DQ2B)/(DQ5B)/(DQ5B)) W17(IO,_DIFFIO_B40p,_(DQ2B)/(DQ5B)/(DQ5B)) W19(IO,_VREFB5N2) W20(IO,_(DQS3R/CQ3R#,CDPCLK4)/(DQS3R/CQ3R#,CDPCLK4)/(DQS3R/CQ3R#,CDPCLK4)) Y2(IO,_DIFFIO_L32p,_(DQ3L)/(DQ3L)/(DQ1L)) Y3(IO,_DIFFIO_B3n,_(DQ3B)/(DQ3B)/(DQ5B)) Y4(IO,_DIFFIO_B3p) Y6(IO,_(DQS1B/CQ1B#,CDPCLK2)/(DQS1B/CQ1B#,CDPCLK2)/(DQS1B/CQ1B#,CDPCLK2)) Y7(IO,_DIFFIO_B7n,_(DQ3B)/(DQ3B)/(DQ5B)) Y8(IO,_DIFFIO_B11p,_(DQ5B)/(DQ3B)/(DQ5B)) Y10(IO,_DIFFIO_B22n,_(DQ5B)/(DQ3B)/(DQ5B)) Y13(IO,_DIFFIO_B28n,_(DQS4B/CQ5B,DPCLK4)/(DQS4B/CQ5B,DPCLK4)/(DQS4B/CQ5B,DPCLK4)) Y14(IO,_DIFFIO_B31p) Y15(IO,_DIFFIO_B31n) Y17(IO,_DIFFIO_B40n,_(DQS0B/CQ1B,CDPCLK3)/(DQS0B/CQ1B,CDPCLK3)/(DQS0B/CQ1B,CDPCLK3)); U59 1(NC); U61 3 4 5 6 11 12 13 14

## Notes on the sheet
- (near C46) FPGA RESET
- FPGA主时钟
- FPGA由EP3C40变更为EP4CE75，管脚调整列表：
  1、信号CY3014_DATA27，连接3C40的G9管脚，但是4CE75该管脚为GND，修改连接到E9管脚。
  2、信号CY3014_DATA24，连接3C40的E10管脚，但是4CE75该管脚为+3V，修改连接到E6管脚。
  3、信号CH04_AA22，连接3C40的AA22管脚，但是4CE75该管脚为GND，修改连接到U19管脚。
  4、信号AA2_BUS2_D5，连接3C40的AA2管脚，但是4CE75该管脚为GND，修改连接到  管脚。
  5、信号U8_SPI_OUT3，连接3C40的U8管脚，但是4CE75该管脚为VCCINT，修改连接到U9 管脚。
  6、信号U7_BUS3_D15，连接3C40的U7管脚，但是4CE75该管脚为GND，修改连接到 T7管脚。
  7、信号AA2_BUS2_D5，连接3C40的AA2管脚，但是4CE75该管脚为GND，修改连接到  管脚。
  8、信号AA2_BUS2_D5，连接3C40的AA2管脚，但是4CE75该管脚为GND，修改连接到  管脚。
  9、信号G2_Main_CLK，连接3C40的G2管脚，但是4CE75该管脚为GND，修改连接到A11 管脚，信号名称变更为A11_Main_CLK。
- 程序下载、固化控制电路
- FPGA电源控制电路
- 配置芯片
- Labels drawn without touching a wire or pin: D_DATA8, D_DATA9, PC0, TEST1, TEST2, TEST3, TEST4
- (in symbol EP4CE75F23I7, part A) BANK 1
- (in symbol EP4CE75F23I7, part B) BANK 2
- (in symbol EP4CE75F23I7, part C) BANK 3
- (in symbol EP4CE75F23I7, part D) BANK 4
- (in symbol EP4CE75F23I7, part E) BANK 5
- (in symbol EP4CE75F23I7, part F) BANK 6
- (in symbol EP4CE75F23I7, part G) BANK 7
- (in symbol EP4CE75F23I7, part H) BANK 8

## Library data of the parts
C46 C348 = CAP: Capacitor
C349-C353 = C
J9 = HEADER 5X2
P4 = Header 5X2: Header, 5-Pin, Dual row; LatestRevisionDate: 17-Jul-2002; LatestRevisionNote: Re-released for DXP Platform.; Publisher: Altium Limited
R64 = res1: Resistor; Published: *; Revision: *; Publisher: *; Value: *
R65 R66 = Res2: Resistor; Value: 5K; Published: 8-Jun-2000; LatestRevisionDate: 17-Jul-2002; LatestRevisionNote: Re-released for DXP Platform.; PackageReference: AXIAL-0.4; Publisher: Altium Limited
R207 R228-R230 R235 R237-R244 R246-R248 = RES2
U56 = EP4CE75F23I7: Cyclone IV Family FPGA, 2V Core, 292 I/O Pins, 4 PLLs, 484-Pin FBGA, Speed Grade 7, Industrial Grade; Published: 3-May-2010; DatasheetVersion: ver1.2, Mar-2010; PackageVersion: ver16.0, Dec-2009; PackageReference: FBGA484; Publisher: Altium Limited; PackageDescription: 484-Ball FineLine Ball Grid Array (FBGA484) - Flip Chip; Supplier 1: Digi-Key; Supplier Part Number 1: EP4CE75F23I7-ND; Code_JEDEC: MS-034-AAJ-1; Code_IPC: BGA100P22X22-484; ComponentLink1Description: Manufacturer Link; ComponentLink1URL: http://www.altera.com/; ComponentLink2Description: Handbook; ComponentLink2URL: http://www.altera.com/literature/hb/cyclone-iv/cyclone4-handbook.pdf; ComponentLink3Description: Pinout Specification; ComponentLink3URL: http://www.altera.com/literature/lit-dp.jsp?category=cyc%204&showspreadsheet=y; ComponentLink4Description: Packaging Specification; ComponentLink4URL: http://www.altera.com/literature/ds/dspkg.pdf
U59 = OSC